# EAGLE design Vers. 3 Moppy Board (EAGLE 9.1.3)
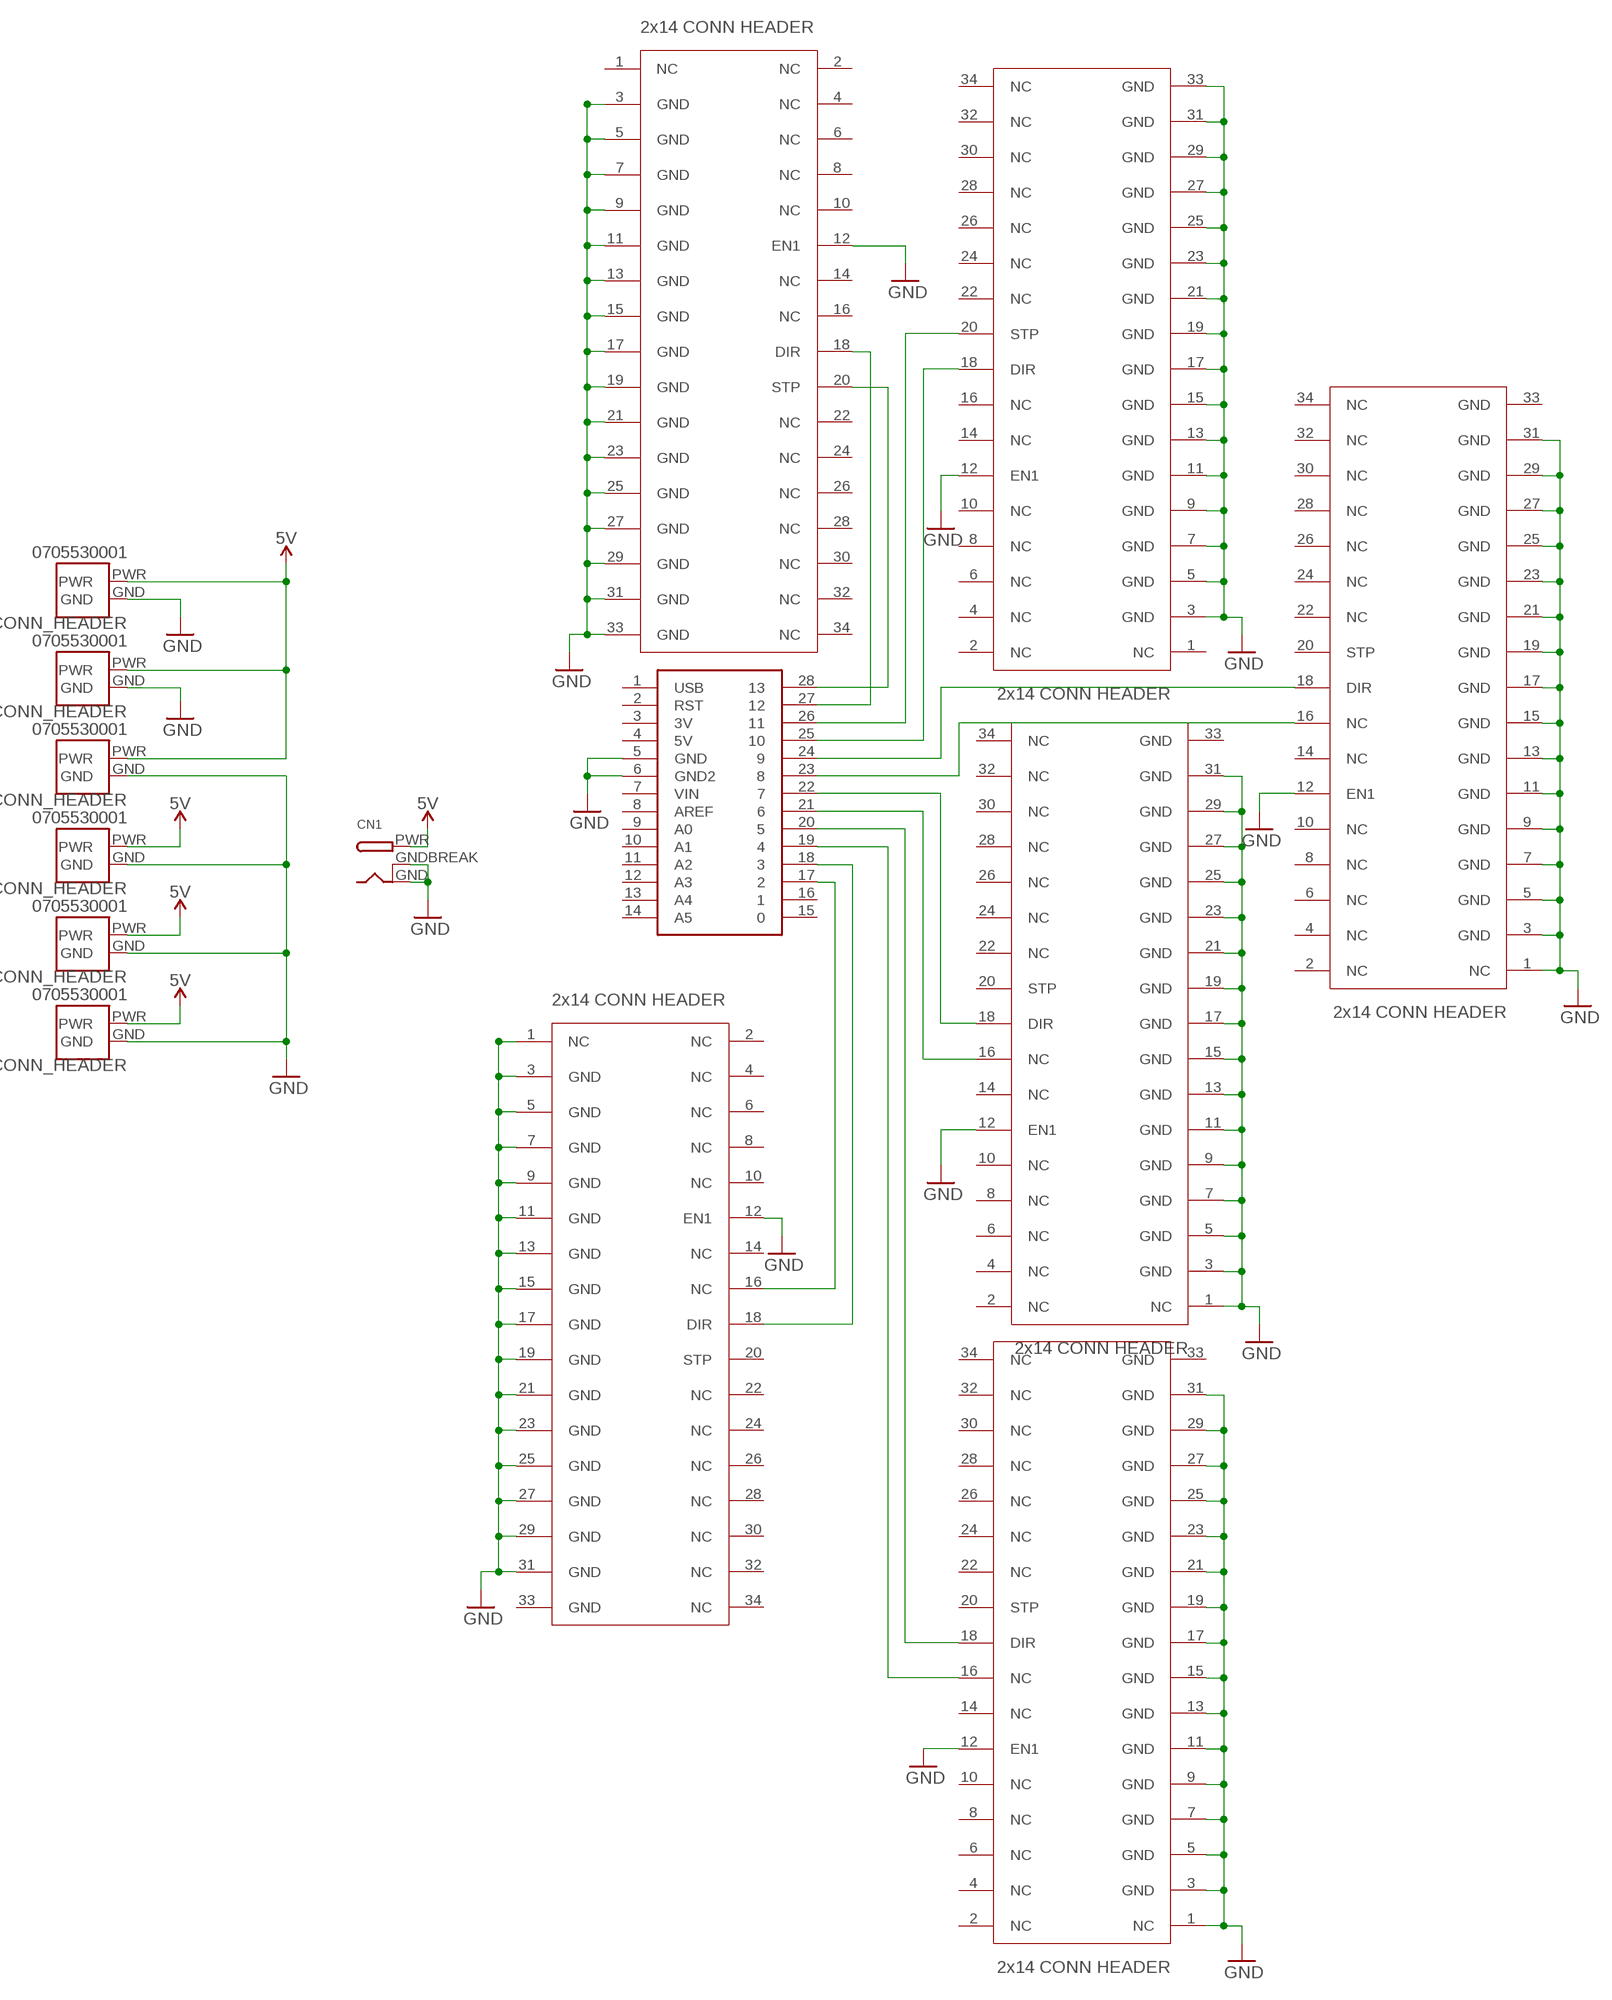
[diagram p0: schematic, sheet 1]

## Parts
CN1  DCBARRELPTH  [DCJACK_2MM_PTH]
U$1  2X14_CONN_HEADER  [2X17_CONN_HEADER]
U$2  2X14_CONN_HEADER  [2X17_CONN_HEADER]
U$3  2X14_CONN_HEADER  [2X17_CONN_HEADER]
U$4  2X14_CONN_HEADER  [2X17_CONN_HEADER]
U$5  2X14_CONN_HEADER  [2X17_CONN_HEADER]
U$6  2X14_CONN_HEADER  [2X17_CONN_HEADER]
U$8  METROMINI  [METROMINI]
X1  0705530001  [MOLEX_0705530001]
X2  0705530001  [MOLEX_0705530001]
X3  0705530001  [MOLEX_0705530001]
X4  0705530001  [MOLEX_0705530001]
X5  0705530001  [MOLEX_0705530001]
X6  0705530001  [MOLEX_0705530001]

## Nets
5V: CN1.PWR X1.PWR X2.PWR X3.PWR X4.PWR X5.PWR X6.PWR
GND: CN1.GND CN1.GNDBREAK U$1.1(NC) U$1.3(GND) U$1.5(GND) U$1.7(GND) U$1.9(GND) U$1.11(GND) U$1.12(EN1) U$1.13(GND) U$1.15(GND) U$1.17(GND) U$1.19(GND) U$1.21(GND) U$1.23(GND) U$1.25(GND) U$1.27(GND) U$1.29(GND) U$1.31(GND) U$2.3(GND) U$2.5(GND) U$2.7(GND) U$2.9(GND) U$2.11(GND) U$2.12(EN1) U$2.13(GND) U$2.15(GND) U$2.17(GND) U$2.19(GND) U$2.21(GND) U$2.23(GND) U$2.25(GND) U$2.27(GND) U$2.29(GND) U$2.31(GND) U$2.33(GND) U$3.3(GND) U$3.5(GND) U$3.7(GND) U$3.9(GND) U$3.11(GND) U$3.12(EN1) U$3.13(GND) U$3.15(GND) U$3.17(GND) U$3.19(GND) U$3.21(GND) U$3.23(GND) U$3.25(GND) U$3.27(GND) U$3.29(GND) U$3.31(GND) U$3.33(GND) U$4.1(NC) U$4.3(GND) U$4.5(GND) U$4.7(GND) U$4.9(GND) U$4.11(GND) U$4.12(EN1) U$4.13(GND) U$4.15(GND) U$4.17(GND) U$4.19(GND) U$4.21(GND) U$4.23(GND) U$4.25(GND) U$4.27(GND) U$4.29(GND) U$4.31(GND) U$5.1(NC) U$5.3(GND) U$5.5(GND) U$5.7(GND) U$5.9(GND) U$5.11(GND) U$5.12(EN1) U$5.13(GND) U$5.15(GND) U$5.17(GND) U$5.19(GND) U$5.21(GND) U$5.23(GND) U$5.25(GND) U$5.27(GND) U$5.29(GND) U$5.31(GND) U$6.1(NC) U$6.3(GND) U$6.5(GND) U$6.7(GND) U$6.9(GND) U$6.11(GND) U$6.12(EN1) U$6.13(GND) U$6.15(GND) U$6.17(GND) U$6.19(GND) U$6.21(GND) U$6.23(GND) U$6.25(GND) U$6.27(GND) U$6.29(GND) U$6.31(GND) U$8.5(GND) U$8.6(GND2) X1.GND X2.GND X3.GND X4.GND X5.GND X6.GND
N$1: U$2.20(STP) U$8.28
N$2: U$2.18(DIR) U$8.27
N$3: U$3.20(STP) U$8.26
N$4: U$3.18(DIR) U$8.25
N$5: U$5.18(DIR) U$8.22
N$6: U$5.16(NC) U$8.21
N$7: U$1.16(NC) U$8.17
N$8: U$4.16(NC) U$8.19
N$9: U$1.18(DIR) U$8.18
N$10: U$6.18(DIR) U$8.24
N$11: U$4.18(DIR) U$8.20
N$12: U$6.16(NC) U$8.23
Unconnected: U$1.2(NC) U$1.4(NC) U$1.6(NC) U$1.8(NC) U$1.10(NC) U$1.14(NC) U$1.20(STP) U$1.22(NC) U$1.24(NC) U$1.26(NC) U$1.28(NC) U$1.30(NC) U$1.32(NC) U$1.33(GND) U$1.34(NC) U$2.1(NC) U$2.2(NC) U$2.4(NC) U$2.6(NC) U$2.8(NC) U$2.10(NC) U$2.14(NC) U$2.16(NC) U$2.22(NC) U$2.24(NC) U$2.26(NC) U$2.28(NC) U$2.30(NC) U$2.32(NC) U$2.34(NC) U$3.1(NC) U$3.2(NC) U$3.4(NC) U$3.6(NC) U$3.8(NC) U$3.10(NC) U$3.14(NC) U$3.16(NC) U$3.22(NC) U$3.24(NC) U$3.26(NC) U$3.28(NC) U$3.30(NC) U$3.32(NC) U$3.34(NC) U$4.2(NC) U$4.4(NC) U$4.6(NC) U$4.8(NC) U$4.10(NC) U$4.14(NC) U$4.20(STP) U$4.22(NC) U$4.24(NC) U$4.26(NC) U$4.28(NC) U$4.30(NC) U$4.32(NC) U$4.33(GND) U$4.34(NC) U$5.2(NC) U$5.4(NC) U$5.6(NC) U$5.8(NC) U$5.10(NC) U$5.14(NC) U$5.20(STP) U$5.22(NC) U$5.24(NC) U$5.26(NC) U$5.28(NC) U$5.30(NC) U$5.32(NC) U$5.33(GND) U$5.34(NC) U$6.2(NC) U$6.4(NC) U$6.6(NC) U$6.8(NC) U$6.10(NC) U$6.14(NC) U$6.20(STP) U$6.22(NC) U$6.24(NC) U$6.26(NC) U$6.28(NC) U$6.30(NC) U$6.32(NC) U$6.33(GND) U$6.34(NC) U$8.1(USB) U$8.2(RST) U$8.3(3V) U$8.4(5V) U$8.7(VIN) U$8.8(AREF) U$8.9(A0) U$8.10(A1) U$8.11(A2) U$8.12(A3) U$8.13(A4) U$8.14(A5) U$8.15 U$8.16

## Library data of the parts
CN1 = adafruit:DCBARREL: 2.0mm DC Barrel Jack DCJACK_2MM_PTH - Through Hole Jack (4UConnector: 05537)
U$1-U$6 = Danielle's Library:2X14_CONN_HEADER
U$8 = MetroMINI:METROMINI
X1-X6 = 2.54_CONN_HEADER:0705530001: Conn Shrouded Header HDR 2 POS 2.54mm Solder RA Thru-Hole SLÃ¢âÂ¢ Tube; DESCRIPTION: Conn Shrouded Header HDR 2 POS 2.54mm Solder RA Thru-Hole SLÃ¢âÂ¢ Tube; DIGI-KEY_PART_NUMBER: WM4900-ND; DIGI-KEY_PURCHASE_URL: https://www.digikey.com/product-detail/en/molex/0705530001/WM4900-ND/114951?utm_source=snapeda&utm_medium=aggregator&utm_campaign=symbol; MF: Molex; MP: 0705530001; PACKAGE: None

## Board
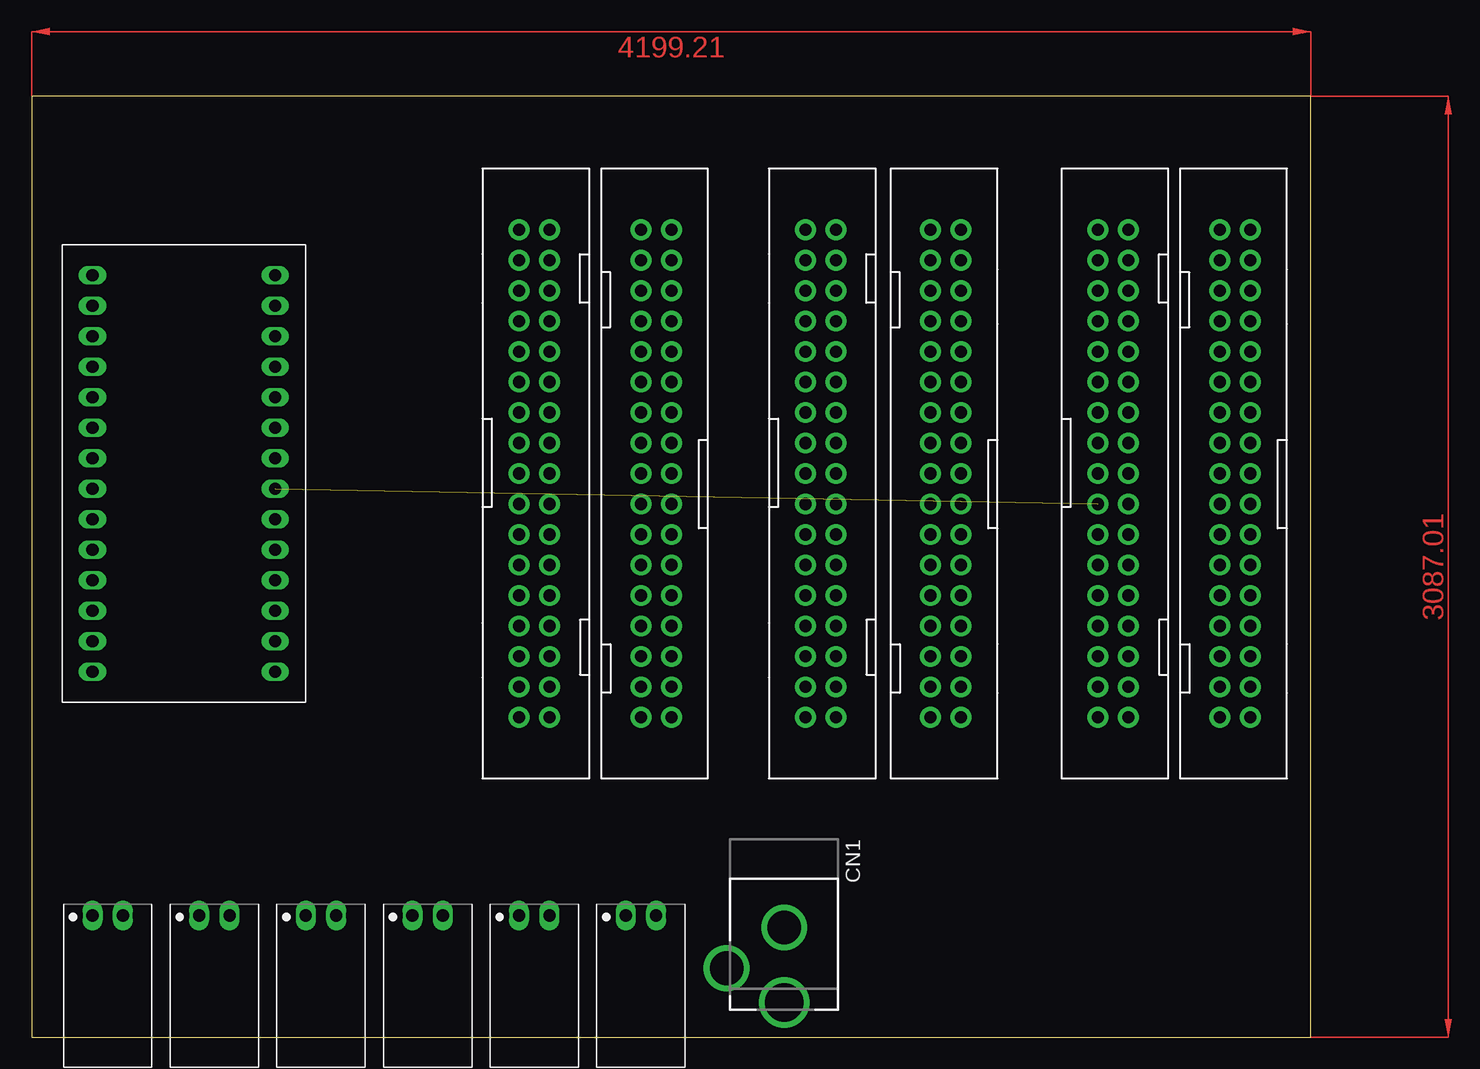
[diagram p1: board, top side]
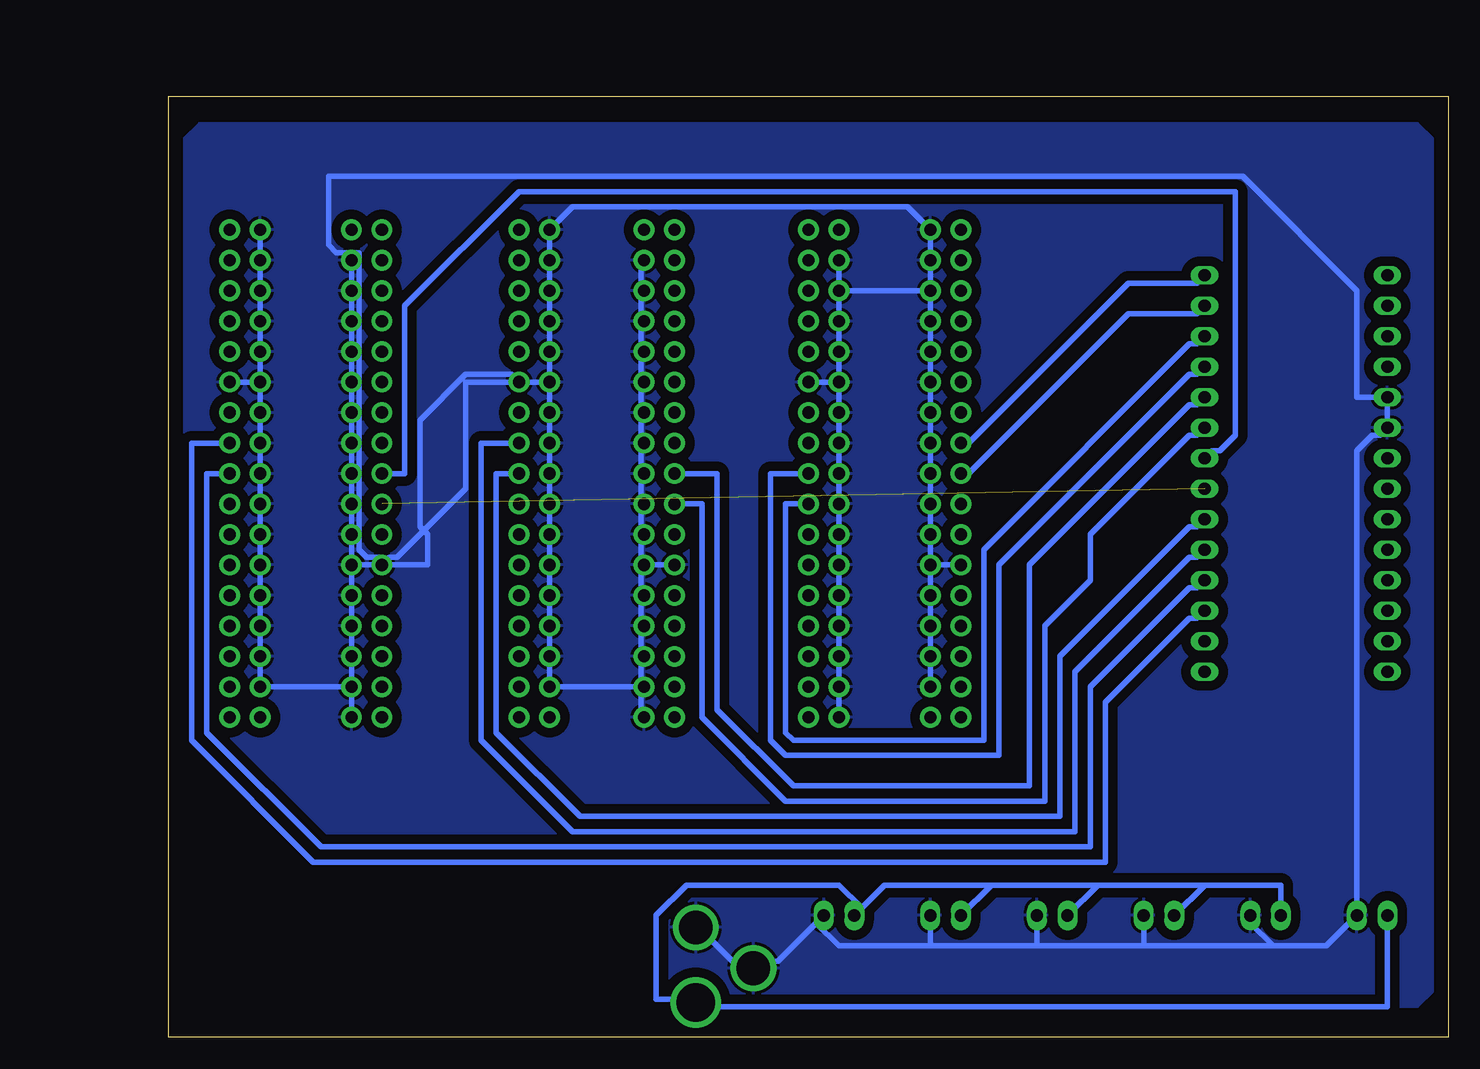
[diagram p2: board, bottom side, seen from below]

Size 106.66 x 78.41 mm. Coordinates in mm from the lower left corner, seen from the top.
Outline: 0,0 106.66,0 106.66,78.41 0,78.41 0,0
Copper layers (1*16): Top 0.035mm / dielectric 1.5mm / Bottom 0.035mm
Design rules "OthermillDRC_1_32_v2 *": minimum track width 18mil, minimum drill 0.8mm, track to track 0.794003125mm, track to pad 0.794003125mm, pad to pad 0.794003125mm, via to via 0.794003125mm, smd to smd 0mil, copper to edge 0mil, drill to drill 1mil, minimum pad ring 10mil, minimum via ring 10mil, stop-mask expansion 1mil, vias tented up to drill 30mil, thermal gap 10mil

### Footprints (pad centres in the part's own frame; a part is rotated, then mirrored left to right if it is on the bottom)
DCJACK_2MM_PTH = drill 2.8: GND 0,7.35; GNDBREAK 4.8,10.75 | drill 3.2: PWR 0,13.6
2X17_CONN_HEADER = drill 1.016 pad 1.727: 1 -25.4,-5.08; 2 -25.4,-2.54; 3 -22.86,-5.08; 4 -22.86,-2.54; 5 -20.32,-5.08; 6 -20.32,-2.54; 7 -17.78,-5.08; 8 -17.78,-2.54; 9 -15.24,-5.08; 10 -15.24,-2.54; 11 -12.7,-5.08; 12 -12.7,-2.54; 13 -10.16,-5.08; 14 -10.16,-2.54; 15 -7.62,-5.08; 16 -7.62,-2.54; 17 -5.08,-5.08; 18 -5.08,-2.54; 19 -2.54,-5.08; 20 -2.54,-2.54; 21 0,-5.08; 22 0,-2.54; 23 2.54,-5.08; 24 2.54,-2.54; 25 5.08,-5.08; 26 5.08,-2.54; 27 7.62,-5.08; 28 7.62,-2.54; 29 10.16,-5.08; 30 10.16,-2.54; 31 12.7,-5.08; 32 12.7,-2.54; 33 15.24,-5.08; 34 15.24,-2.54
METROMINI = drill 1.016 long: 1 -11.43,0; 2 -8.89,0; 3 -6.35,0; 4 -3.81,0; 5 -1.27,0; 6 1.27,0; 7 3.81,0; 8 6.35,0; 9 8.89,0; 10 11.43,0; 11 13.97,0; 12 16.51,0; 13 19.05,0; 14 21.59,0; 15 21.59,15.24; 16 19.05,15.24; 17 16.51,15.24; 18 13.97,15.24; 19 11.43,15.24; 20 8.89,15.24; 21 6.35,15.24; 22 3.81,15.24; 23 1.27,15.24; 24 -1.27,15.24; 25 -3.81,15.24; 26 -6.35,15.24; 27 -8.89,15.24; 28 -11.43,15.24
MOLEX_0705530001 = drill 1.016 pad 1.651 long: GND 2.54,0; PWR 0,0

### Placement (x,y rotation side)
CN1  62.74,16.51 180 top
U$1  104.14,41.91 270 top
U$2  38.1,52.07 90 top
U$3  55.88,41.91 270 top
U$4  80.01,41.91 270 top
U$5  86.36,52.07 90 top
U$6  61.98,52.07 90 top
U$8  5.08,52.07 270 top
X1  49.53,10.16 0 top
X2  40.64,10.16 0 top
X3  5.08,10.16 0 top
X4  13.97,10.16 0 top
X5  22.86,10.16 0 top
X6  31.75,10.16 0 top

### Tracks (layer width: path | path; a pad name or v marks a point on that pad's centre or on a via)
5V
  Bottom 0.457: X4.PWR 13.97,12.7 20.32,12.7 | X5.PWR 20.32,12.7 | 29.21,12.7 X6.PWR | 20.32,12.7 29.21,12.7 | 38.1,12.7 X2.PWR | 29.21,12.7 38.1,12.7 | 48.9,10.79 46.99,12.7 38.1,12.7 | X3.PWR 5.08,2.54 62.23,2.54 CN1.PWR 62.87,3.17 66.04,3.17 66.04,10.16 63.5,12.7 50.8,12.7 48.9,10.79 | 48.9,10.79 X1.PWR
GND
  Bottom 0.457: U$5.3 U$5.1 | U$5.3 U$5.5 U$5.7 U$5.9 U$5.11 | U$5.31 U$5.29 U$5.27 U$5.25 U$5.23 U$5.21 U$5.19 U$5.17 U$5.15 U$5.13 U$5.11 | U$5.11 U$5.12 88.26,40.01 87.63,40.01 81.91,45.72 81.91,54.61 U$4.12 | U$1.1 U$1.3 U$1.5 U$1.7 U$1.9 U$1.11 | U$1.11 U$1.12 | U$1.11 U$1.13 U$1.15 U$1.17 U$1.19 U$1.21 U$1.23 U$1.25 U$1.27 U$1.29 U$1.31 U$5.3 | U$3.3 U$3.5 | U$3.11 U$3.13 U$3.15 U$3.17 U$3.19 U$3.21 U$3.23 U$3.25 U$3.27 U$3.29 U$3.31 U$3.33 | U$3.11 U$3.12 | U$3.11 U$3.9 U$3.7 U$3.5 | U$2.3 U$2.5 U$2.7 U$2.9 U$2.11 | U$2.29 U$2.31 U$2.33 45.09,69.21 73.03,69.21 U$4.1 U$4.3 U$4.5 U$4.7 U$4.9 U$4.11 | U$2.11 U$2.12 | U$2.11 U$2.13 U$2.15 U$2.17 U$2.19 U$2.21 U$2.23 U$2.25 U$2.27 U$2.29 | U$2.29 U$3.5 | 67.31,29.21 67.31,26.67 U$6.1 | 67.31,34.29 67.31,31.75 | 67.31,31.75 67.31,29.21 | 67.31,31.75 U$6.5 | 67.31,62.23 67.31,64.77 U$6.31 | 67.31,59.69 67.31,57.15 | 67.31,54.61 67.31,52.07 | 67.31,49.53 67.31,46.99 | 67.31,44.45 67.31,41.91 | U$6.12 U$6.11 67.31,39.37 | 67.31,39.37 67.31,36.83 | 67.31,39.37 67.31,41.91 | 67.31,41.91 U$6.13 | 67.31,44.45 67.31,46.99 | 67.31,46.99 U$6.17 | 67.31,44.45 U$6.15 | 67.31,49.53 67.31,52.07 | 67.31,52.07 U$6.21 | 67.31,49.53 U$6.19 | 67.31,54.61 67.31,57.15 | 67.31,57.15 U$6.25 | 67.31,54.61 U$6.23 | 67.31,59.69 67.31,62.23 | 67.31,62.23 U$6.29 | 67.31,59.69 U$6.27 | 67.31,36.83 67.31,34.29 | 67.31,34.29 U$6.7 | 67.31,36.83 U$6.9 | U$4.11 U$4.12 | U$4.11 U$4.13 U$4.15 U$4.17 U$4.19 U$4.21 U$4.23 U$4.25 U$4.27 U$4.29 U$4.31 67.31,29.21 | 67.31,29.21 U$6.3 | 52.71,9.52 55.88,6.35 57.79,6.35 CN1.GNDBREAK 58.42,6.35 59.69,6.35 62.23,8.89 CN1.GND | 14.6,7.62 10.16,7.62 X3.GND 7.62,48.9 6.35,50.16 5.71,50.16 U$8.6 U$8.5 7.62,53.34 7.62,62.23 17.14,71.75 93.34,71.75 93.34,66.04 92.71,65.41 90.81,65.41 90.81,40.64 90.17,40.01 88.9,40.01 88.26,39.37 85.09,39.37 85.09,41.91 85.72,42.55 85.72,51.44 81.91,55.25 78.1,55.25 U$4.12
  Bottom 0.457: 14.6,7.62 16.51,9.52 X4.GND | 25.4,7.62 X5.GND | 14.6,7.62 25.4,7.62 | 34.29,7.62 X6.GND | 25.4,7.62 34.29,7.62 | 43.18,7.62 X2.GND | 34.29,7.62 43.18,7.62 | 52.71,9.52 50.8,7.62 43.18,7.62 | 52.71,9.52 X1.GND
  pour Bottom: 1.27,3.81 1.27,74.93 2.54,76.2 104.14,76.2 105.41,74.93 105.41,6.35 101.6,2.54 2.54,2.54
N$1
  Bottom 0.457: U$8.28 20.95,62.87 26.67,62.87 40.01,49.53 U$2.20
N$2
  Bottom 0.457: U$8.27 20.95,60.32 26.67,60.32 40.01,46.99 U$2.18
N$3
  Bottom 0.457: U$8.26 20.95,57.79 21.59,57.79 38.73,40.64 38.73,24.76 54.61,24.76 55.24,25.4 55.24,44.45 U$3.20
N$4
  Bottom 0.457: U$8.25 20.95,55.25 21.59,55.25 37.46,39.37 37.46,23.49 55.24,23.49 56.51,24.76 56.51,46.99 U$3.18
N$5
  Bottom 0.457: U$8.22 19.69,48.9 19.05,48.9 17.78,50.16 17.78,70.48 77.47,70.48 87,60.96 87,46.99 U$5.18
N$6  (1 unrouted)
N$7
  Bottom 0.457: U$8.17 20.95,34.93 21.59,34.93 28.57,27.94 28.57,14.61 94.62,14.61 104.78,24.76 104.78,49.53 U$1.16
N$8
  Bottom 0.457: U$8.19 20.95,40.01 21.59,40.01 31.12,30.48 31.12,17.14 73.03,17.14 80.65,24.76 80.65,49.53 U$4.16
N$9
  Bottom 0.457: U$8.18 20.95,37.47 21.59,37.47 29.84,29.21 29.84,15.88 93.98,15.88 103.5,25.4 103.5,46.99 U$1.18
N$10
  Bottom 0.457: U$8.24 20.95,52.71 21.59,52.71 34.93,39.37 34.93,20.95 54.61,20.95 60.96,27.3 60.96,46.99 U$6.18
N$11
  Bottom 0.457: U$8.20 20.95,42.55 21.59,42.55 32.38,31.75 32.38,18.41 72.39,18.41 79.38,25.4 79.38,46.99 U$4.18
N$12
  Bottom 0.457: U$8.23 20.95,50.16 21.59,50.16 29.84,41.91 29.84,38.1 33.66,34.29 33.66,19.68 55.24,19.68 62.23,26.67 62.23,44.45 U$6.16
(copper drawn outside any net)
  shapes: Top area x2